# Altium schematic sheet Spolerigg1.SchDoc: TK531 Utgangstrinn
size A4; Author: Øystein Smith; Organization: Omega Verksted; DocumentNumber: 18; Revision: 2; SheetNumber: 18; SheetTotal: 20
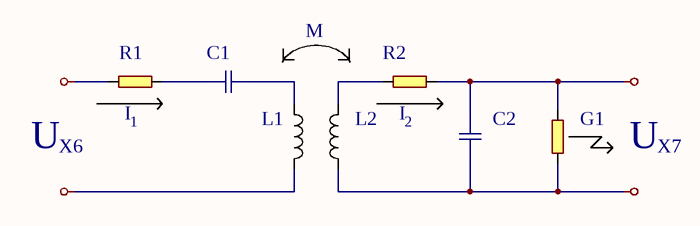
[diagram p0: Spolerigg1.SchDoc]

## Parts
C1  PC/HV/S/WF 22NF  [CAPAD340W1L280D11B]  (value not drawn)
C2  PC/HV/S/WF 22NF  [CAPAD340W1L280D11B]  (value not drawn)
G1  1.0  [RESA_0.25W]  (value not drawn)
L1  SMD spoler  [INDP3225X20N]  (value not drawn)
L2  SMD spoler  [INDP3225X20N]  (value not drawn)
R1  1.0  [RESA_0.25W]  (value not drawn)
R2  1.0  [RESA_0.25W]  (value not drawn)

## Nets
GND: C2.1 G1.1 L1.2 L2.1
IN: R1.1
OUT: C2.2 G1.2 R2.2
NetC1_1: C1.1 R1.2
NetC1_2: C1.2 L1.1
NetL2_2: L2.2 R2.1

## Notes on the sheet
- M
- U
- X6
- (near R1) I
- (near R1) 1
- (near R2) I
- (near R2) 2
- X7
- Size:
- Date:
- Title:
- A3
- Revision:
- Sheet
- of
- Author:
- File:

## Library data of the parts
C1 C2 = 3176: CAP, FILM, PP, 22NF, 1.5KV, AXIAL; id: 3176; pakke_opprettet_av: 815; leverandor_varenr: 9520384; pris: 10; nokkelord: Capacitor, Kondensator; produsent: LCR Components; leverandor: Farnell; pakketype: TH; pakke_opprettet: 07.06.2015 15:46:51; symbol_opprettet_av: 815; symbol_opprettet: 14.11.2014 20:19:34; navn: PC/HV/S/WF 22NF
G1 R1 R2 = 2747: 0.25W 1% Generic resistor; id: 2747; rad: 0; rom: OV; lager_type: Fremlager; hylle: 8; antall: 100; pakke_opprettet_av: 815; pakke_opprettet: 28.06.2014 17.13.33; symbol_opprettet: 08.07.2014 21.16.33; nokkelord: Motstand, Resistor; pakketype: TH; dybde: 0; kolonne: 0; symbol_opprettet_av: 815; navn: 1.0; pris: 0
L1 L2 = 1739: SMD inductors og tomme SMD bokser; id: 1739; pakke_opprettet_av: 924; pris: -1; pakke_opprettet: 26.05.2015 23:51:10; symbol_opprettet_av: 924; symbol_opprettet: 27.05.2015 00:20:21; navn: SMD spoler; pakketype: SMD